# Altium schematic sheet [0]-Power Blocks Diagram.SchDoc: RK3399 SOM Board Design V1.0
size A3; Author: ABC; Organization: Altium Limited; Address1: L3, 12a Rodborough Rd; Address2: Frenchs Forest; Address3: NSW; Address4: Australia 2086; DocumentNumber: 2; SheetNumber: 2; SheetTotal: 21; PROJECT CODE: A_V1.0
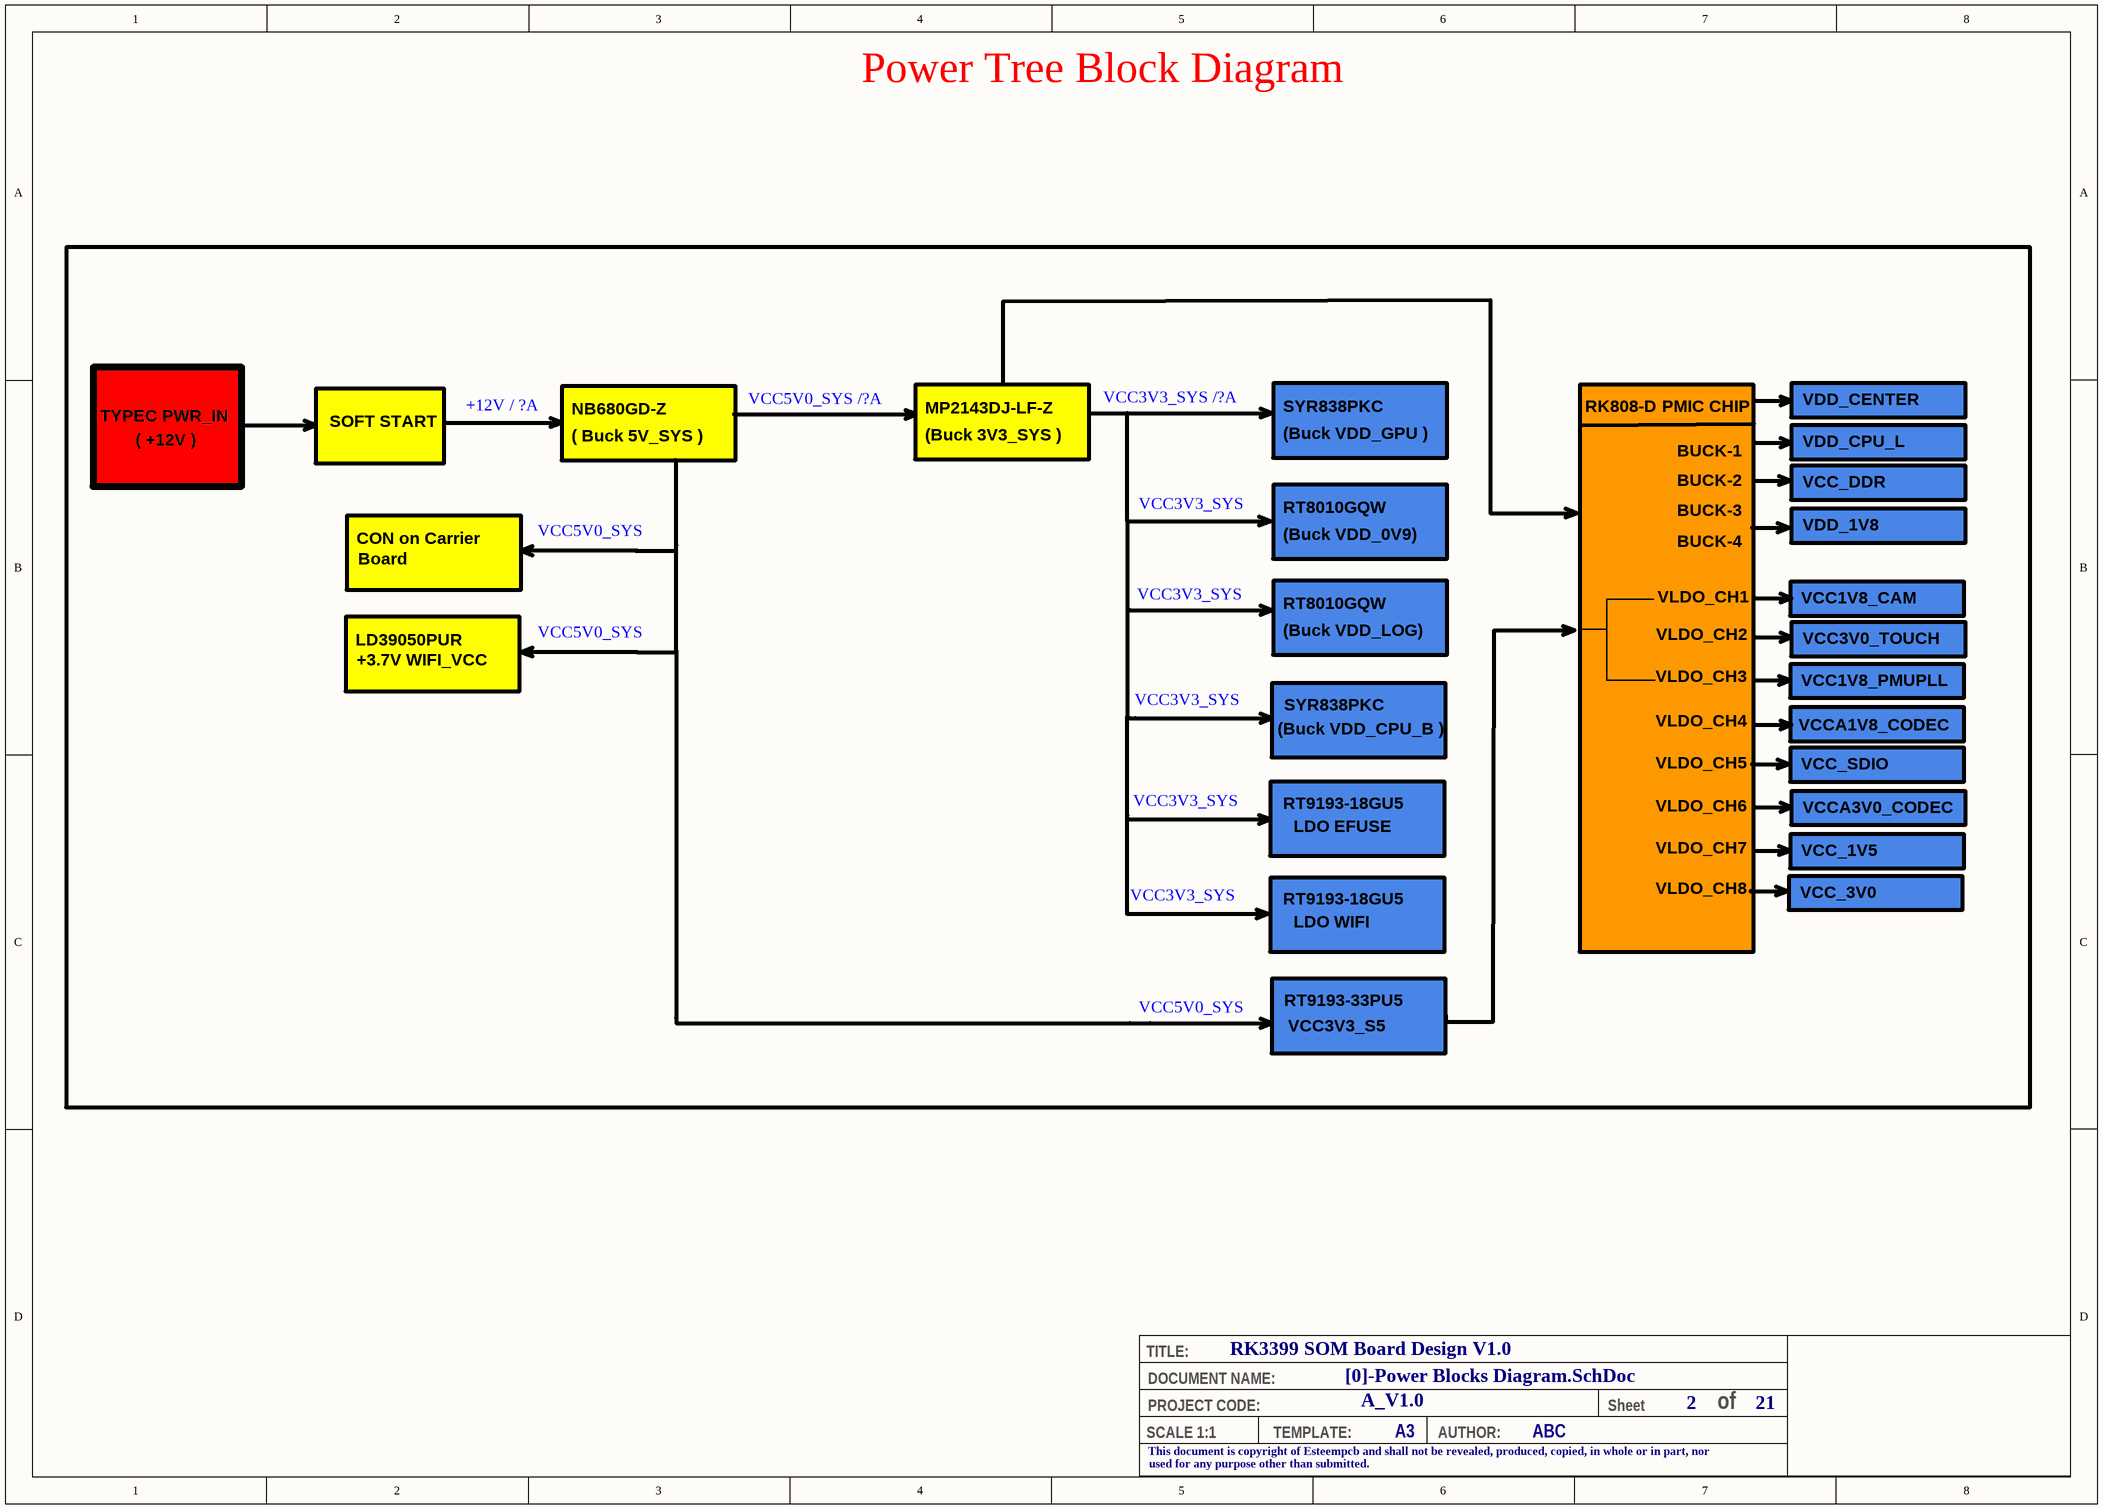
[diagram p0: [0]-Power Blocks Diagram.SchDoc]

## Notes on the sheet
- Power Tree Block Diagram
- TYPEC PWR_IN
- ( +12V )
- SOFT START
- +12V / ?A
- NB680GD-Z
- ( Buck 5V_SYS )
- VCC5V0_SYS /?A
- MP2143DJ-LF-Z
- (Buck 3V3_SYS )
- VCC3V3_SYS /?A
- SYR838PKC
- (Buck VDD_GPU )
- RK808-D
- PMIC CHIP
- VDD_CENTER
- VDD_CPU_L
- VCC3V3_SYS
- RT8010GQW
- BUCK-1
- BUCK-2
- BUCK-3
- VCC_DDR
- CON on Carrier
- Board
- VCC5V0_SYS
- (Buck VDD_0V9)
- BUCK-4
- VDD_1V8
- LD39050PUR
- (Buck VDD_LOG)
- VLDO_CH2
- VLDO_CH1
- VCC1V8_CAM
- VCC3V0_TOUCH
- +3.7V WIFI_VCC
- VLDO_CH3
- VCC1V8_PMUPLL
- (Buck VDD_CPU_B )
- VLDO_CH4
- VLDO_CH5
- VCCA1V8_CODEC
- VCC_SDIO
- RT9193-18GU5
- LDO EFUSE
- VLDO_CH6
- VLDO_CH7
- VCC_1V5
- VCCA3V0_CODEC
- VLDO_CH8
- VCC_3V0
- LDO WIFI
- RT9193-33PU5
- VCC3V3_S5
- TITLE:
- DOCUMENT NAME:
- SCALE 1:1
- This document is copyright of Esteempcb and shall not be revealed, produced, copied, in whole or in part, nor
- PROJECT CODE:
- TEMPLATE:
- A3
- AUTHOR:
- Sheet
- of
- used for any purpose other than submitted.